# EAGLE design Board (EAGLE 9.0.1)

## Sheet 1 of 3
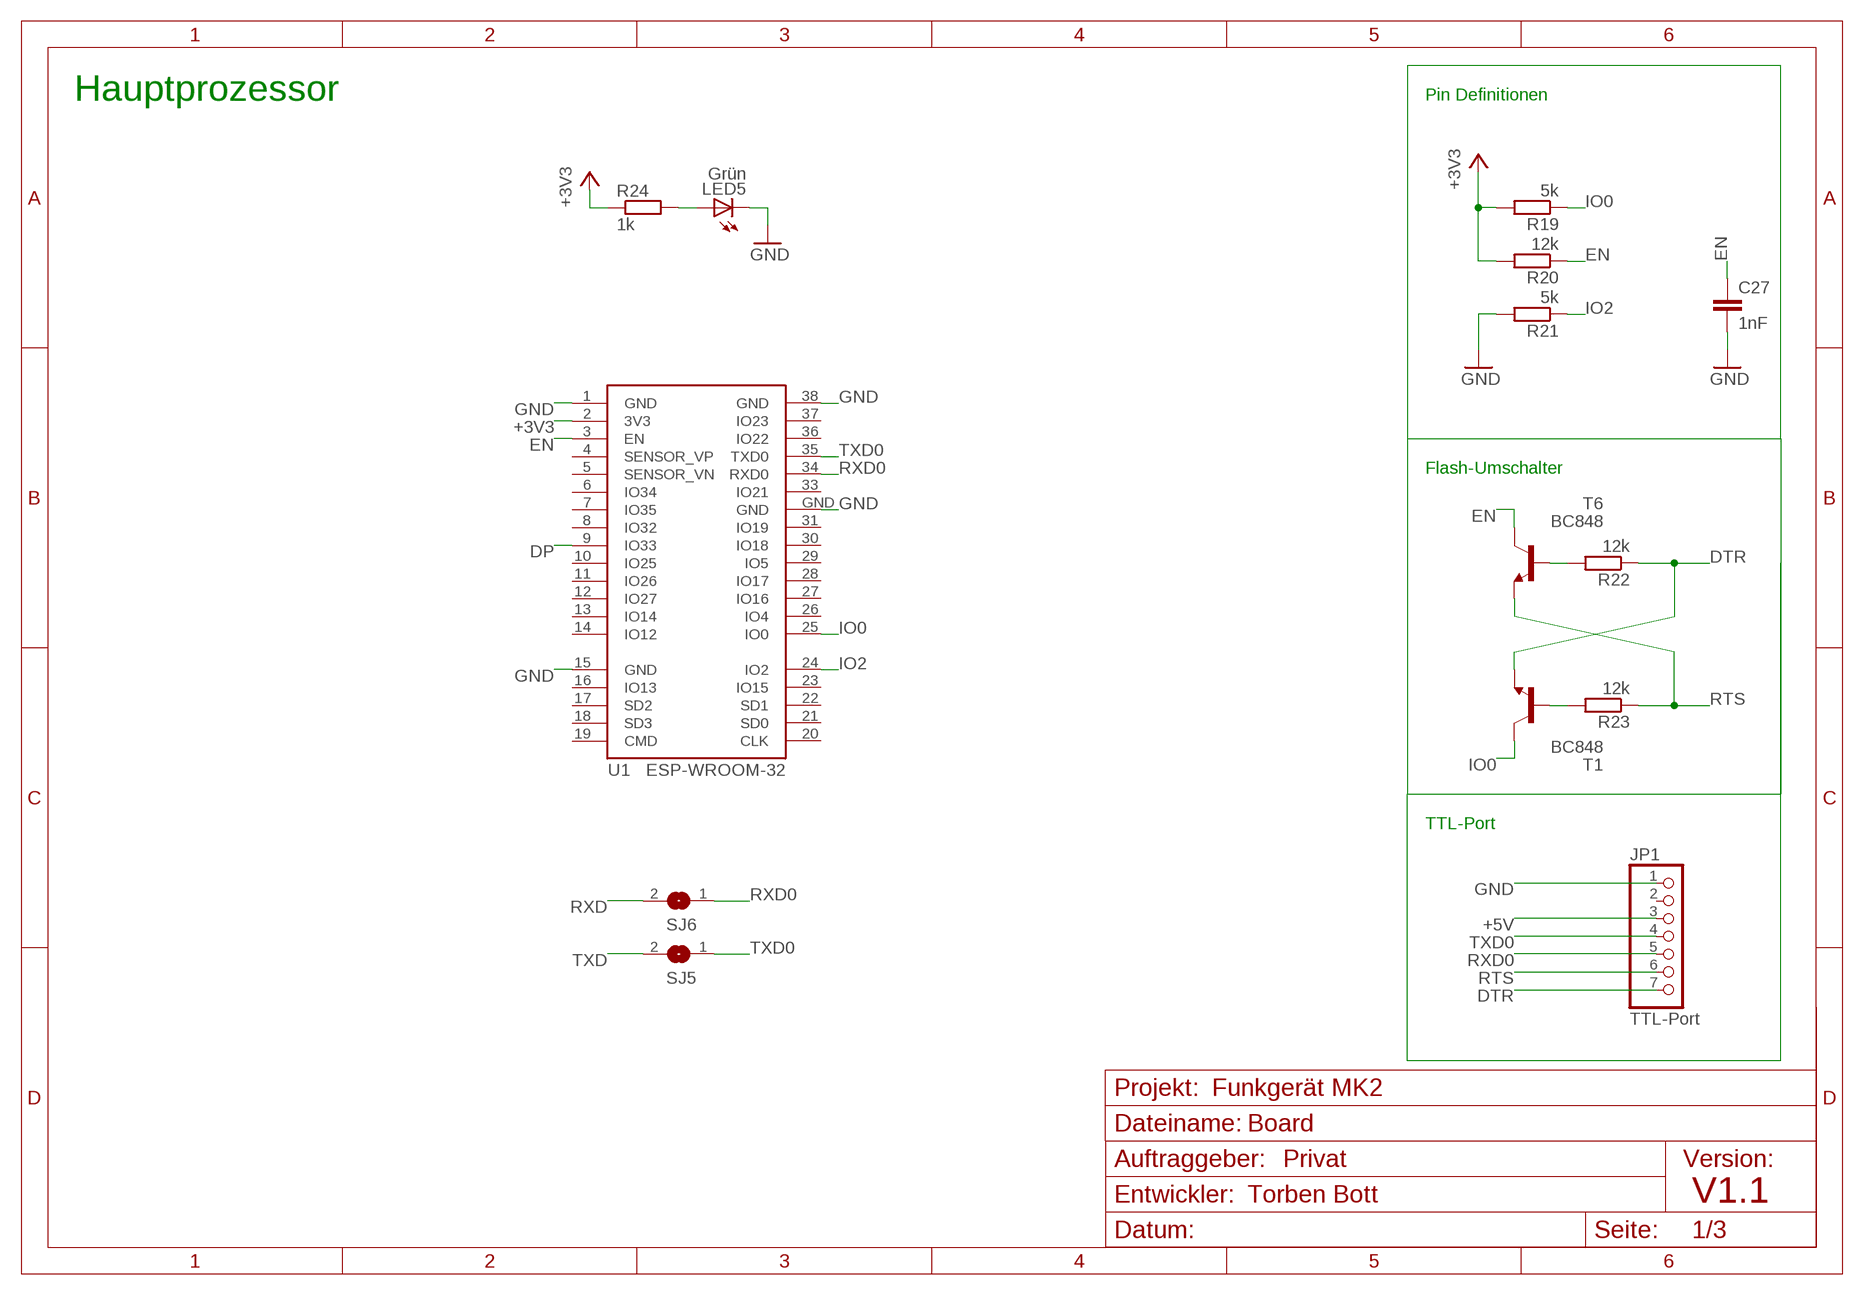
[diagram p0: schematic, sheet 1]

### Parts
C27  1nF  C-EUC0805  [C0805]
JP1  TTL-Port  PINHD-1X7/90  [1X07/90]
LED5  Grün  LEDCHIP-LED0805  [CHIP-LED0805]
R19  5k  R-EU_R0805  [R0805]
R20  12k  R-EU_R0805  [R0805]
R21  5k  R-EU_R0805  [R0805]
R22  12k  R-EU_R0805  [R0805]
R23  12k  R-EU_R0805  [R0805]
R24  1k  R-EU_R0805  [R0805]
SJ5  SJ  [SJ]
SJ6  SJ  [SJ]
T1  BC848  [SOT23]
T6  BC848  [SOT23]
U1  ESP-WROOM-32  [ESP-WROOM-32]

### Nets
+3V3: R19.2 R20.2 R24.1 U1.2(3V3) ; also sheet 2,3
+5V: JP1.3 ; also sheet 2
DP: U1.9(IO33) ; also sheet 3
DTR: JP1.7 R22.1 T1.2(E)
EN: C27.1 R20.1 T6.3(C) U1.3(EN)
GND: C27.2 JP1.1 LED5.C R21.2 U1.1(GND) U1.15(GND) U1.38(GND) U1.GND ; also sheet 2,3
IO0: R19.1 T1.3(C) U1.25(IO0)
IO2: R21.1 U1.24(IO2)
N$40: R23.2 T1.1(B)
N$41: R22.2 T6.1(B)
N$43: LED5.A R24.2
RTS: JP1.6 R23.1 T6.2(E)
RXD: SJ6.2 ; also sheet 3
RXD0: JP1.5 SJ6.1 U1.34(RXD0)
TXD: SJ5.2 ; also sheet 3
TXD0: JP1.4 SJ5.1 U1.35(TXD0)
Unconnected: JP1.2 U1.4(SENSOR_VP) U1.5(SENSOR_VN) U1.6(IO34) U1.7(IO35) U1.8(IO32) U1.10(IO25) U1.11(IO26) U1.12(IO27) U1.13(IO14) U1.14(IO12) U1.16(IO13) U1.17(SD2) U1.18(SD3) U1.19(CMD) U1.20(CLK) U1.21(SD0) U1.22(SD1) U1.23(IO15) U1.26(IO4) U1.27(IO16) U1.28(IO17) U1.29(IO5) U1.30(IO18) U1.31(IO19) U1.33(IO21) U1.36(IO22) U1.37(IO23)

### Notes on the sheet
- Hauptprozessor | Pin Definitionen
- Flash-Umschalter
- TTL-Port
- Funkgerät MK2
- Privat
- Torben Bott | V1.1

## Sheet 2 of 3
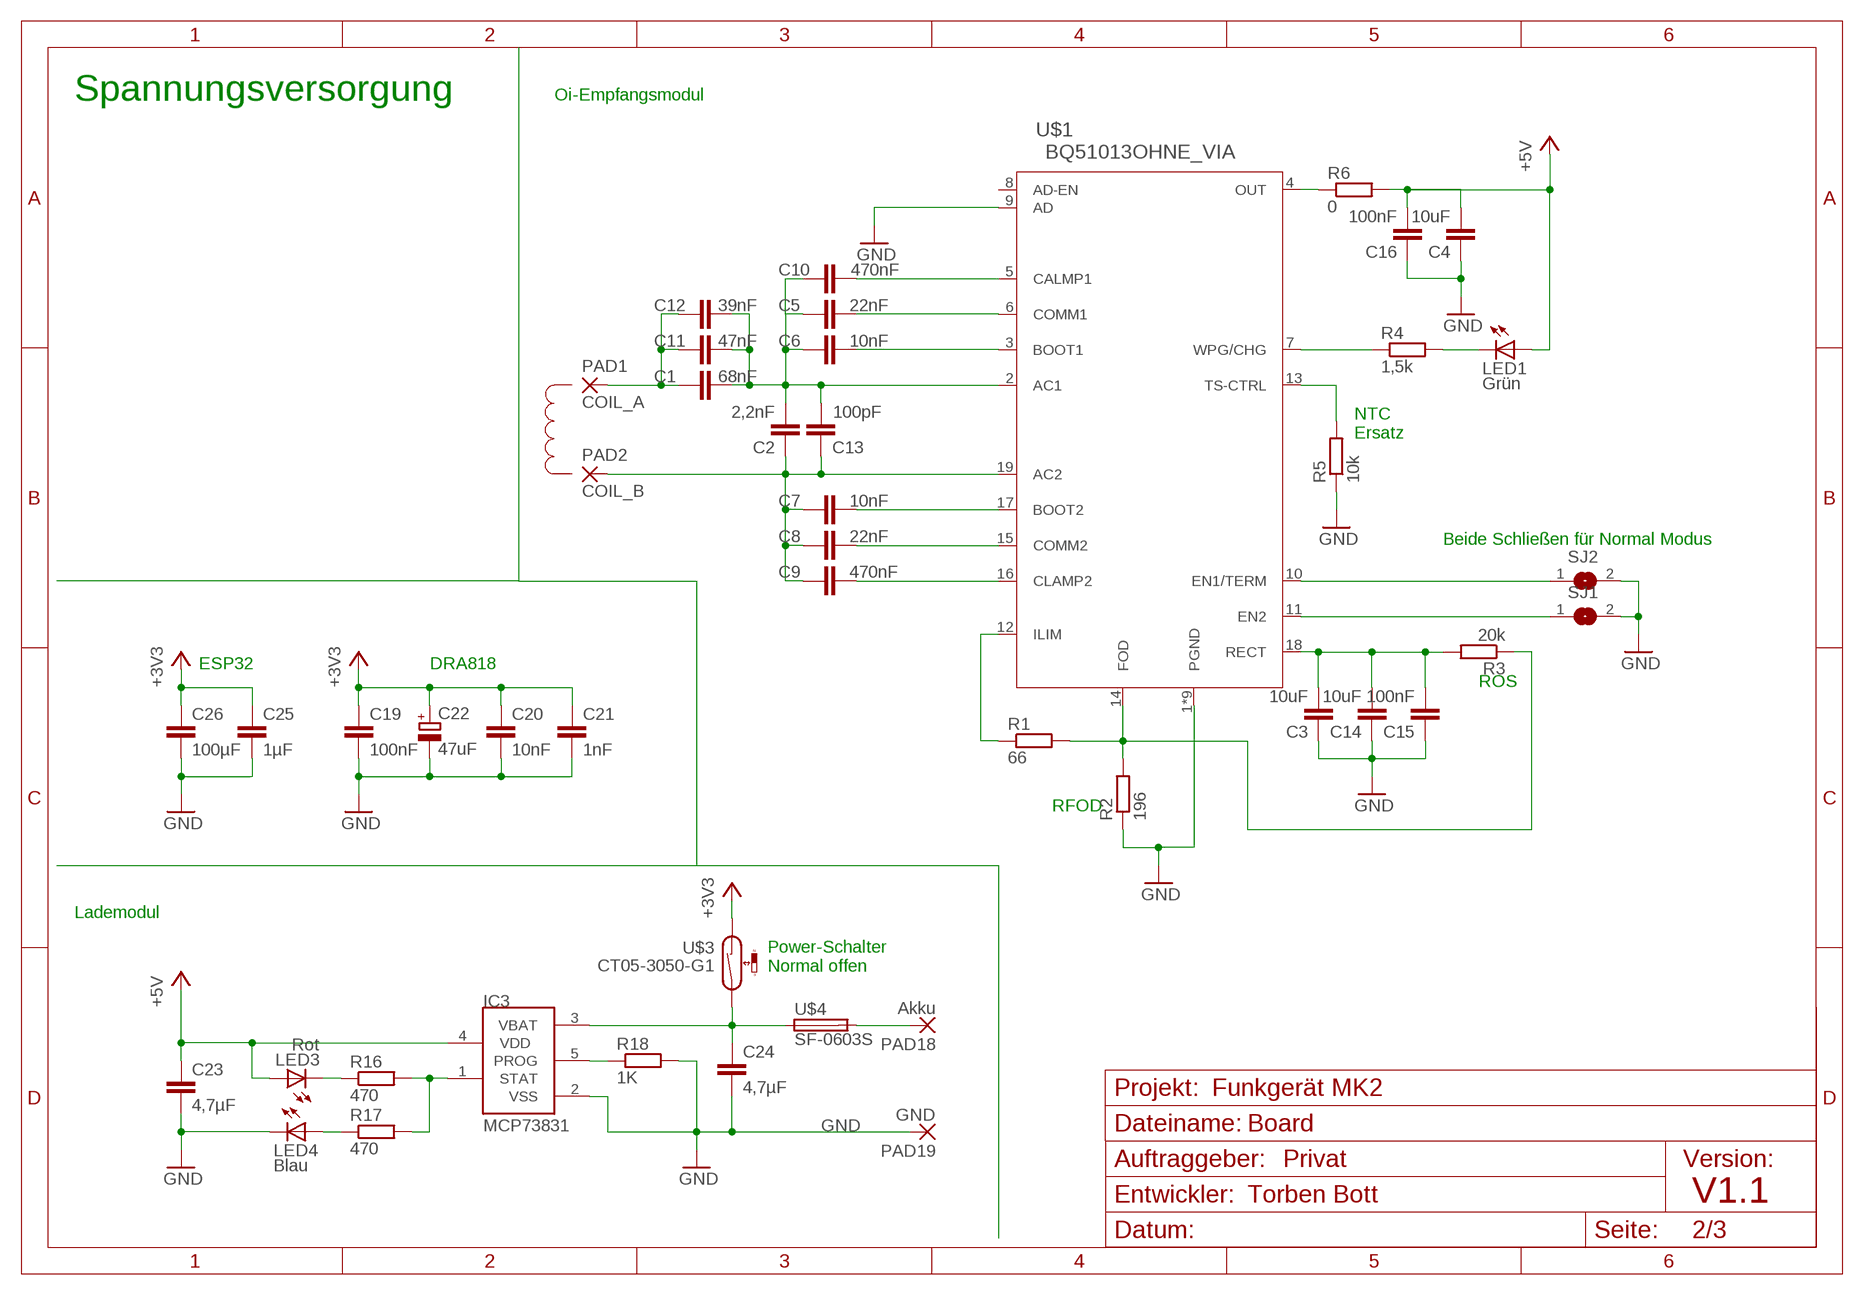
[diagram p1: schematic, sheet 2]

### Parts
C1  68nF  C-EUC0805  [C0805]
C2  2,2nF  C-EUC0805  [C0805]
C3  10uF  C-EUC0805  [C0805]
C4  10uF  C-EUC0805  [C0805]
C5  22nF  C-EUC0805  [C0805]
C6  10nF  C-EUC0805  [C0805]
C7  10nF  C-EUC0805  [C0805]
C8  22nF  C-EUC0805  [C0805]
C9  470nF  C-EUC0805  [C0805]
C10  470nF  C-EUC0805  [C0805]
C11  47nF  C-EUC0805  [C0805]
C12  39nF  C-EUC0805  [C0805]
C13  100pF  C-EUC0805  [C0805]
C14  10uF  C-EUC0805  [C0805]
C15  100nF  C-EUC0805  [C0805]
C16  100nF  C-EUC0805  [C0805]
C19  100nF  C-EUC0805  [C0805]
C20  10nF  C-EUC0805  [C0805]
C21  1nF  C-EUC0805  [C0805]
C22  47uF  CPOL-EUCT6032  [CT6032]
C23  4,7µF  C-EUC0805  [C0805]
C24  4,7µF  C-EUC0805  [C0805]
C25  1µF  C-EUC0805  [C0805]
C26  100µF  C-EUC0805  [C0805]
IC3  MCP73831  [SOT23-5L]
LED1  Grün  LEDCHIP-LED0805  [CHIP-LED0805]
LED3  Rot  LEDCHIPLED_0805  [CHIPLED_0805]
LED4  Blau  LEDCHIPLED_0805  [CHIPLED_0805]
PAD1  COIL_A  WIREPADSMD5-2,5  [5-2,5]
PAD2  COIL_B  WIREPADSMD5-2,5  [5-2,5]
PAD18  Akku  WIREPADSMD5-1,8  [5-1,8]
PAD19  GND  WIREPADSMD5-1,8  [5-1,8]
R1  66  R-EU_R0805  [R0805]
R2  196  R-EU_R0805  [R0805]
R3  20k  R-EU_R0805  [R0805]
R4  1,5k  R-EU_R0805  [R0805]
R5  10k  R-EU_R0805  [R0805]
R6  0  R-EU_R0805  [R0805]
R16  470  R-EU_R0805  [R0805]
R17  470  R-EU_R0805  [R0805]
R18  1K  R-EU_R0805  [R0805]
SJ1  SJ  [SJ]
SJ2  SJ  [SJ]
U$1  BQ51013OHNE_VIA  [QFN20_3,5X4,5_OHNE]
U$3  CT05-3050-G1  [CT10-A2]
U$4  SF-0603S  [R0603]

### Nets
+3V3: C19.1 C20.1 C21.1 C22.+ C25.1 C26.1 U$3.P$1 ; also sheet 1,3
+5V: C4.2 C16.2 C23.1 IC3.4(VDD) LED1.A LED3.A R6.2 ; also sheet 1
BATT+: C24.1 IC3.3(VBAT) U$3.P$2 U$4.1
GND: C3.1 C4.1 C14.1 C15.1 C16.1 C19.2 C20.2 C21.2 C22.- C23.2 C24.2 C25.2 C26.2 IC3.2(VSS) LED4.C PAD19.1(P) R2.1 R5.1 R18.2 SJ1.2 SJ2.2 U$1.1(PGND) U$1.9(AD) U$1.20(PGND) U$1.EXP(PGND) U$1.EXP@7(PGND) U$1.EXP@8(PGND) U$1.EXP@9(PGND) U$1.EXP@10(PGND) U$1.EXP@11(PGND) U$1.EXP@12(PGND) ; also sheet 1,3
N$1: C1.1 C11.1 C12.1 PAD1.1(P)
N$2: C10.1 U$1.5(CALMP1)
N$3: C5.1 U$1.6(COMM1)
N$4: C1.2 C2.2 C5.2 C6.2 C10.2 C11.2 C12.2 C13.2 U$1.2(AC1)
N$5: C7.1 U$1.17(BOOT2)
N$6: C2.1 C7.2 C8.2 C9.2 C13.1 PAD2.1(P) U$1.19(AC2)
N$7: C8.1 U$1.15(COMM2)
N$8: C9.1 U$1.16(CLAMP2)
N$9: C6.1 U$1.3(BOOT1)
N$10: R1.1 U$1.12(ILIM)
N$12: PAD18.1(P) U$4.2
N$13: C3.2 C14.2 C15.2 R3.2 U$1.18(RECT)
N$14: SJ2.1 U$1.10(EN1/TERM)
N$15: LED1.C R4.2
N$16: R6.1 U$1.4(OUT)
N$17: R4.1 U$1.7(WPG/CHG)
N$18: R5.2 U$1.13(TS-CTRL)
N$19: SJ1.1 U$1.11(EN2)
N$36: IC3.1(STAT) R16.2 R17.2
N$37: LED3.C R16.1
N$38: LED4.A R17.1
N$39: IC3.5(PROG) R18.1
N$47: R1.2 R2.2 R3.1 U$1.14(FOD)
Unconnected: U$1.8(AD-EN)

### Notes on the sheet
- Spannungsversorgung | Oi-Empfangsmodul
- NTC
  Ersatz
- Beide Schließen für Normal Modus
- ESP32 | DRA818
- ROS
- RFOD
- Lademodul
- Power-Schalter
  Normal offen
- Funkgerät MK2
- Privat
- Torben Bott | V1.1

## Sheet 3 of 3
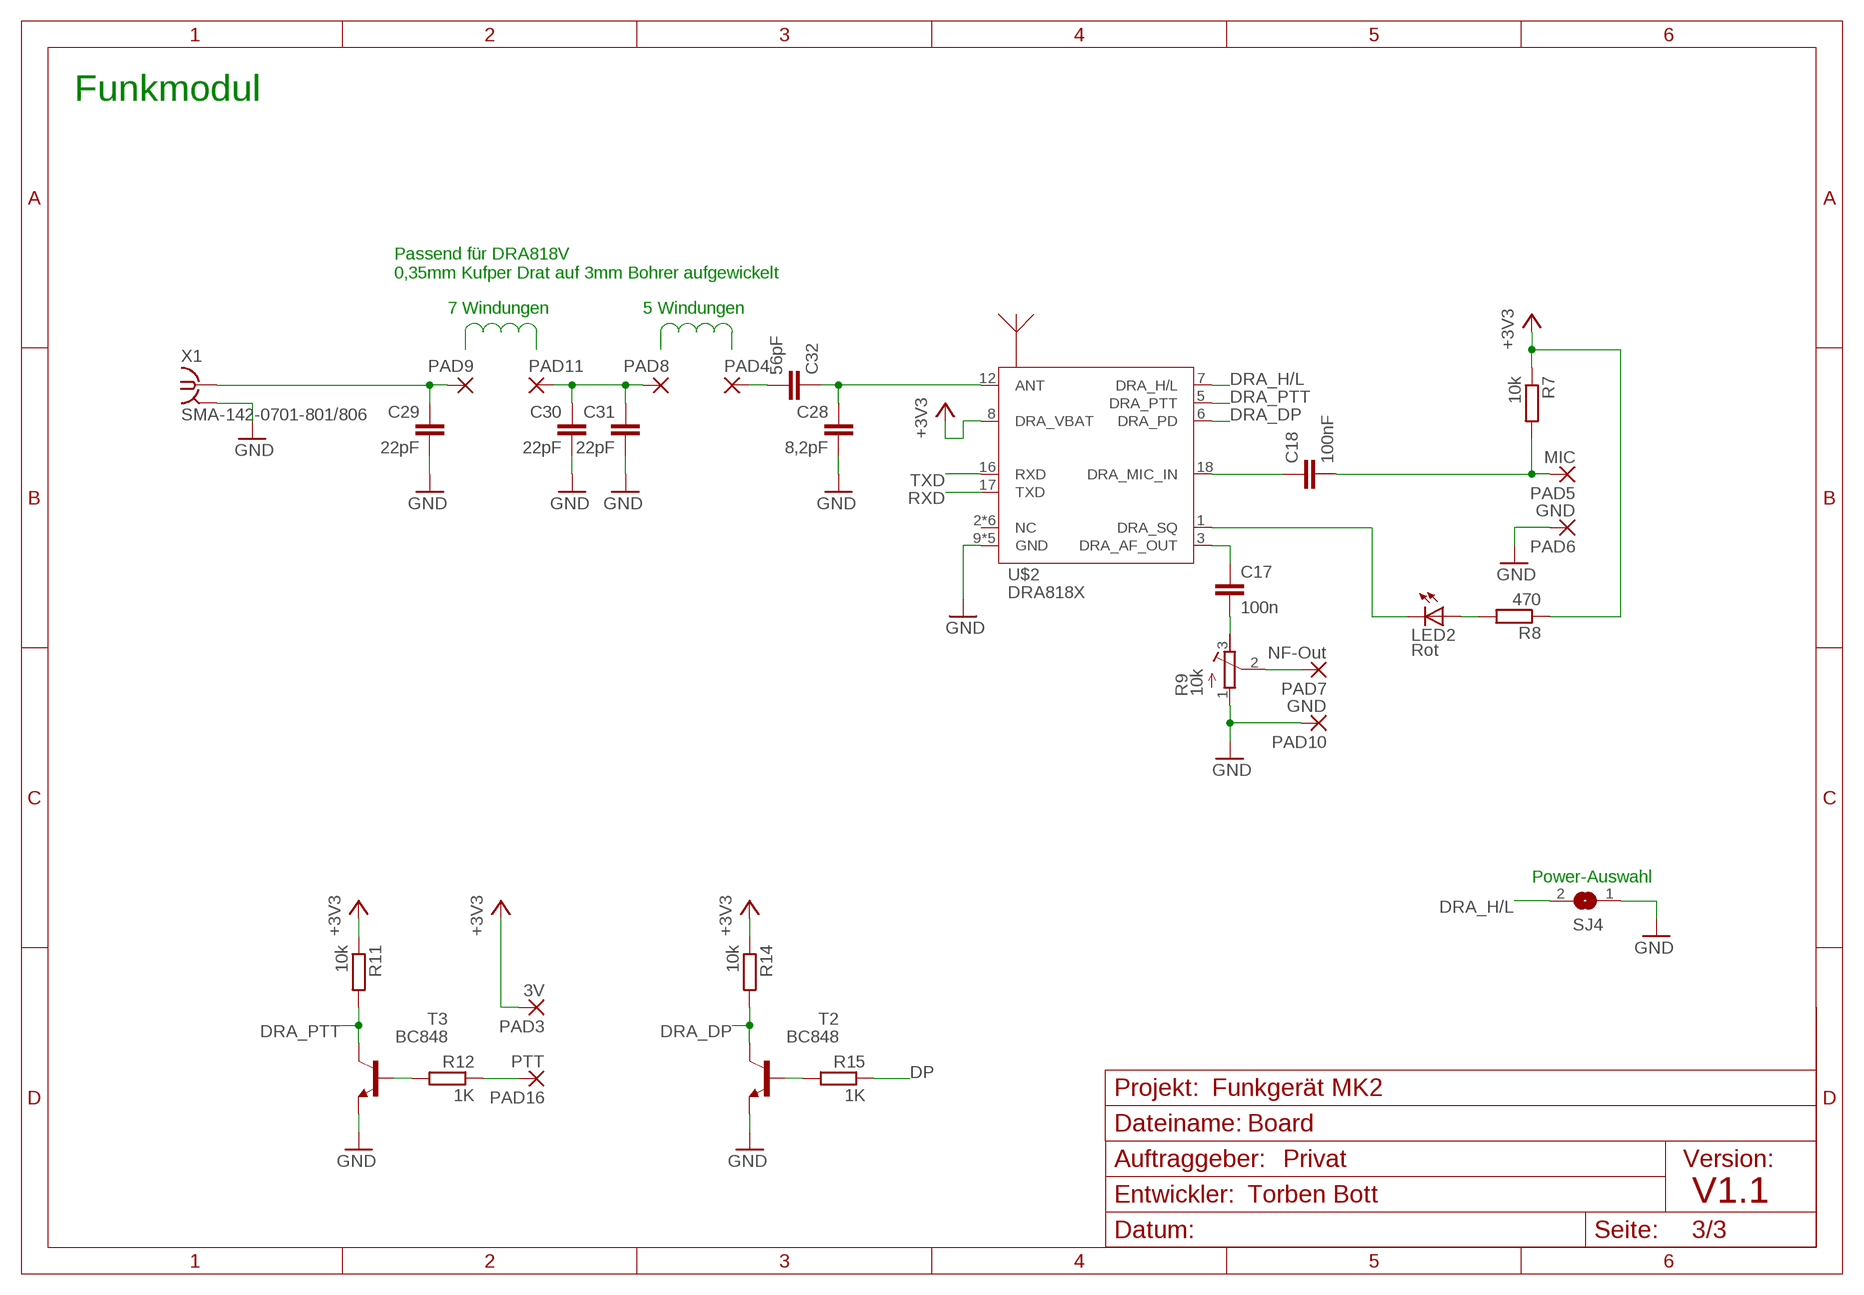
[diagram p2: schematic, sheet 3]

### Parts
C17  100n  C-EUC0805  [C0805]
C18  100nF  C-EUC0805  [C0805]
C28  8,2pF  C-EUC1206K  [C1206K]
C29  22pF  C-EUC1206K  [C1206K]
C30  22pF  C-EUC1206K  [C1206K]
C31  22pF  C-EUC1206K  [C1206K]
C32  56pF  C-EUC1206K  [C1206K]
LED2  Rot  LEDCHIP-LED0805  [CHIP-LED0805]
PAD3  3V  WIREPADSMD5-1,8  [5-1,8]
PAD4  WIREPADSMD5-1,8  [5-1,8]
PAD5  MIC  WIREPADSMD5-1,8  [5-1,8]
PAD6  GND  WIREPADSMD5-1,8  [5-1,8]
PAD7  NF-Out  WIREPADSMD5-1,8  [5-1,8]
PAD8  WIREPADSMD5-1,8  [5-1,8]
PAD9  WIREPADSMD5-1,8  [5-1,8]
PAD10  GND  WIREPADSMD5-1,8  [5-1,8]
PAD11  WIREPADSMD5-1,8  [5-1,8]
PAD16  PTT  WIREPADSMD5-1,8  [5-1,8]
R7  10k  R-EU_R0805  [R0805]
R8  470  R-EU_R0805  [R0805]
R9  10k  R-TRIMMTS63Y  [RTRIMTS63Y]
R11  10k  R-EU_R0805  [R0805]
R12  1K  R-EU_R0805  [R0805]
R14  10k  R-EU_R0805  [R0805]
R15  1K  R-EU_R0805  [R0805]
SJ4  SJ  [SJ]
T2  BC848  [SOT23]
T3  BC848  [SOT23]
U$2  DRA818X  [DRA818X]
X1  SMA-142-0701-801/806  [J502-ND-142-0701-801/806]

### Nets
+3V3: PAD3.1(P) R7.1 R8.1 R11.1 R14.1 U$2.8(DRA_VBAT) ; also sheet 1,2
DP: R15.1 ; also sheet 1
DRA_DP: R14.2 T2.3(C) U$2.6(DRA_PD)
DRA_H/L: SJ4.2 U$2.7(DRA_H/L)
DRA_PTT: R11.2 T3.3(C) U$2.5(DRA_PTT)
GND: C28.2 C29.2 C30.2 C31.2 PAD6.1(P) PAD10.1(P) R9.1(A) SJ4.1 T2.2(E) T3.2(E) U$2.9(GND) U$2.10(GND) U$2.P1(GND) U$2.P2(GND) U$2.P3(GND) X1.G@1 X1.G@2 X1.G@3 X1.G@4 ; also sheet 1,2
N$20: C18.1 U$2.18(DRA_MIC_IN)
N$21: C18.2 PAD5.1(P) R7.2
N$22: LED2.A R8.2
N$23: C17.1 U$2.3(DRA_AF_OUT)
N$24: C17.2 R9.3(E)
N$25: C28.1 C32.1 U$2.12(ANT)
N$26: PAD7.1(P) R9.2(S)
N$27: C32.2 PAD4.1(P)
N$28: C30.1 C31.1 PAD8.1(P) PAD11.1(P)
N$29: LED2.C U$2.1(DRA_SQ)
N$30: R12.2 T3.1(B)
N$31: C29.1 PAD9.1(P) X1.1
N$32: R15.2 T2.1(B)
N$33: PAD16.1(P) R12.1
RXD: U$2.17(TXD) ; also sheet 1
TXD: U$2.16(RXD) ; also sheet 1
Unconnected: U$2.2(NC) U$2.4(NC) U$2.11(NC) U$2.13(NC) U$2.14(NC) U$2.15(NC)

### Notes on the sheet
- Funkmodul
- Passend für DRA818V
  0,35mm Kufper Drat auf 3mm Bohrer aufgewickelt
- 7 Windungen | 5 Windungen
- Power-Auswahl
- Funkgerät MK2
- Privat
- Torben Bott | V1.1

## Library data of the parts
C1-C21 C26 C28-C32 = rcl:C-EU: CAPACITOR, European symbol; SPICEPREFIX: C
C22 = rcl:CPOL-EU: POLARIZED CAPACITOR, European symbol; SPICEPREFIX: C
C23-C25 C27 = rcl:C-EU: CAPACITOR, European symbol
IC3 = microchip-update-2:MCP73831: Miniature Single-Cell, Fully Integrated Li-Ion, Li-Polymer Charge Management Controllers
JP1 = pinhead:PINHD-1X7: PIN HEADER
LED1-LED5 = led:LED: LED OSRAM: - CHIPLED LG R971, LG N971, LY N971, LG Q971, LY Q971, LO R971, LY R971 LH N974, LH R974 LS Q976, LO Q976, LY Q976 LO Q996 - Hyper CHIPLED LW Q18S LB Q993, LB Q99A, LB R99A - SideLED LS A670, LO A670, LY A670, LG A670, LP A670 LB A673, LV A673, LT A673, LW A673 LH A674 LY A675 LS A676, LA A676, LO A676, LY A676, LW A676 LS A679, LY A679, LG A679 - Hyper Micro SIDELED® LS Y876, LA Y876, LO Y876, LY Y876 LT Y87S - SmartLED LW L88C, LW L88S LB L89C, LB L89S, LG L890 LS L89K, LO L89K, LY L89K LS L896, LA L896, LO L896, LY L896 - TOPLED LS T670, LO T670, LY T670, LG T670, LP T670 LSG T670, LSP T670, LSY T670, LOP T670, LYG T670 LG T671, LOG T671, LSG T671 LB T673, LV T673, LT T673, LW T673 LH T674 LS T676, LA T676, LO T676, LY T676, LB T676, LH T676, LSB T676, LW T676 LB T67C, LV T67C, LT T67C, LS T67K, LO T67K, LY T67K, LW E67C LS E67B, LA E67B, LO E67B, LY E67B, LB E67C, LV E67C, LT E67C LW T67C LS T679, LY T679, LG T679 LS T770, LO T770, LY T770, LG T770, LP T770 LB T773, LV T773, LT T773, LW T773 LH T774 LS E675, LA E675, LY E675, LS T675 LS T776, LA T776, LO T776, LY T776, LB T776 LHGB T686 LT T68C, LB T68C - Hyper Mini TOPLED® LB M676 - Mini TOPLED Santana® LG M470 LS M47K, LO M47K, LY M47K Source: http://www.osram.convergy.de LUXEON: - LUMILED® LXK2-PW12-R00, LXK2-PW12-S00, LXK2-PW14-U00, LXK2-PW14-V00 LXK2-PM12-R00, LXK2-PM12-S00, LXK2-PM14-U00 LXK2-PE12-Q00, LXK2-PE12-R00, LXK2-PE12-S00, LXK2-PE14-T00, LXK2-PE14-U00 LXK2-PB12-K00, LXK2-PB12-L00, LXK2-PB12-M00, LXK2-PB14-N00, LXK2-PB14-P00, LXK2-PB14-Q00 LXK2-PR12-L00, LXK2-PR12-M00, LXK2-PR14-Q00, LXK2-PR14-R00 LXK2-PD12-Q00, LXK2-PD12-R00, LXK2-PD12-S00 LXK2-PH12-R00, LXK2-PH12-S00 LXK2-PL12-P00, LXK2-PL12-Q00, LXK2-PL12-R00 Source: www.luxeon.com KINGBRIGHT: KA-3528ASYC Source: www.kingbright.com
PAD1-PAD11 PAD16 PAD18 PAD19 = wirepad:WIREPAD: Wire PAD connect wire on PCB
R1-R8 R11 R14 R24 = rcl:R-EU_: RESISTOR, European symbol; SPICEPREFIX: R
R9 = rcl:R-TRIMM: Trimm resistor; SPICEMODEL: X; SPICEPREFIXL: POT
R12 R15-R23 = rcl:R-EU_: RESISTOR, European symbol
SJ1 SJ2 SJ4-SJ6 = jumper:SJ: SMD solder JUMPER
T1-T3 T6 = transistor:BC848: NPN TRANSISTOR
U1 = esp32:ESP-WROOM-32: Espressif Systems ESP-WROOM-32
U$1 = Eigene Library:BQ51013
U$2 = Eigene Library:DRA818X
U$3 = Eigene Library:CT05-3050-G1; FARNELL: 1081684
U$4 = Eigene Library:SF-0603S; FARNELL: 1652144
X1 = con-coax:SMA-: SMA 50 Ohm End Launch Jack Receptacle - Round Contact Johnson Components Source: www.johnsoncomponents.com .. J502-ND.pdf; MF: JOHNSON COMPONENTS; MPN: 142-0701-801; OC_FARNELL: 1608592; OC_NEWARK: 90F2624

## Board
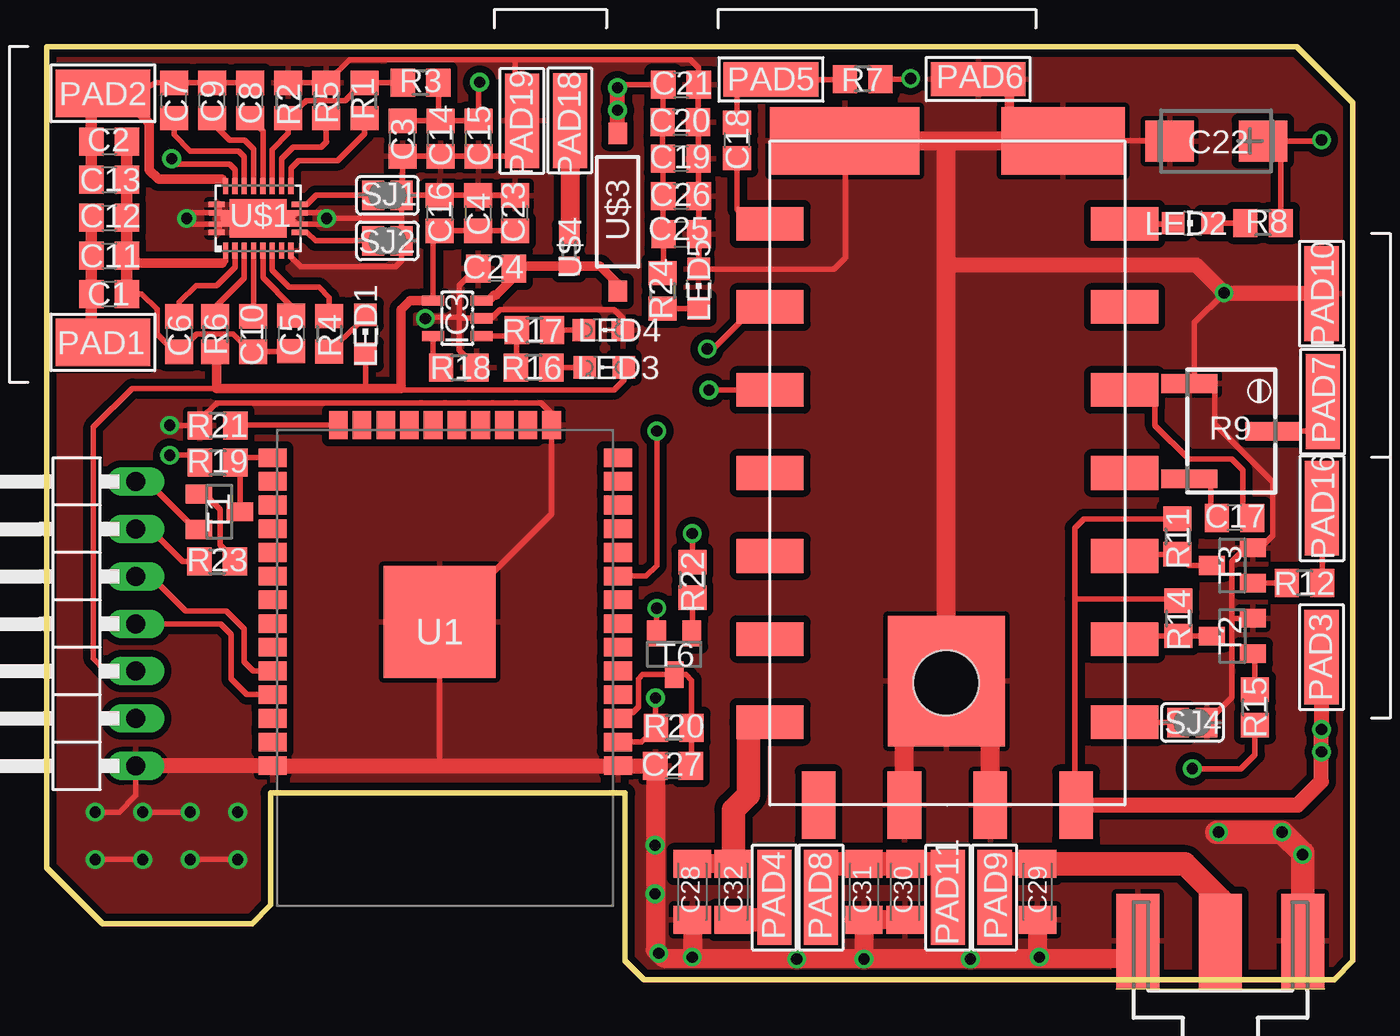
[diagram p3: board, top side]
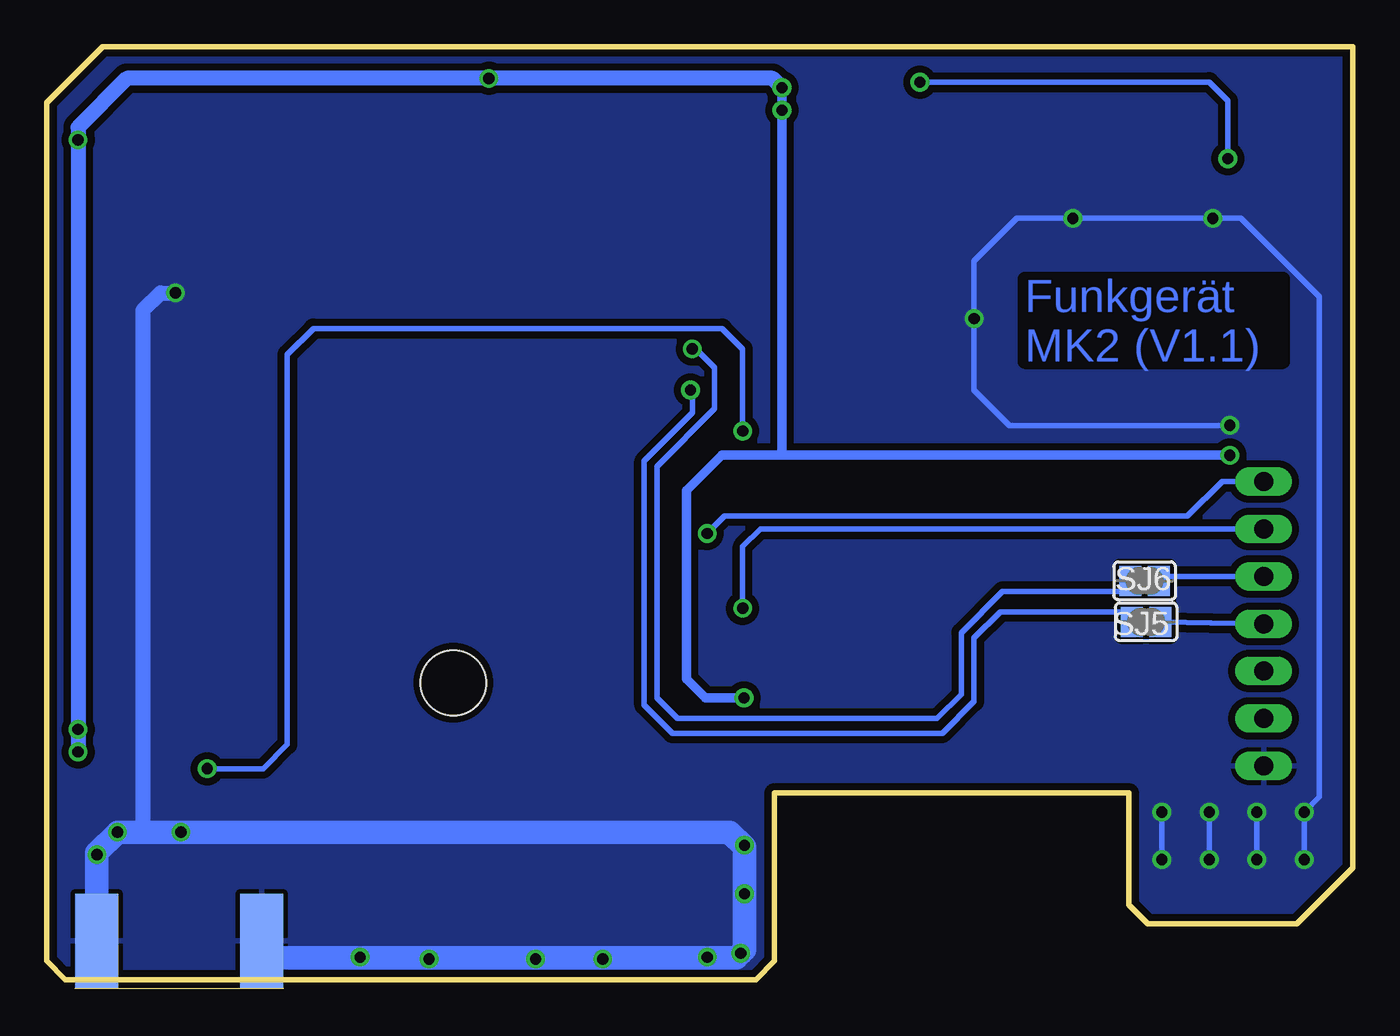
[diagram p4: board, bottom side, seen from below]

Size 70 x 50 mm. Coordinates in mm from the lower left corner, seen from the top.
Outline: 0,50 67,50 70,47 70,1 69,0 32,0 31,1 31,10 12,10 12,4 11,3 3,3 0,6 0,50
Copper layers (1*16): Top 0.035mm / dielectric 1.5mm / Bottom 0.035mm
Design rules "Torben": minimum track width 12mil, minimum drill 0.6mm, track to track 15mil, track to pad 8mil, pad to pad 6mil, via to via 6mil, smd to smd 6mil, copper to edge 15mil, drill to drill 6mil, minimum pad ring 10mil, minimum via ring 8mil, stop-mask expansion 4mil, vias tented up to drill 0mil, thermal gap 10mil
Holes 3.5 mm at 48.2,15.9

### Footprints (pad centres in the part's own frame; a part is rotated, then mirrored left to right if it is on the bottom)
C0805 = smd 1.3 x 1.5: 1 -0.95,0; 2 0.95,0
CT6032 = smd 2.6 x 2.2: + -2.5,0; - 2.5,0
C1206K = smd 1.5 x 2: 1 -1.5,0; 2 1.5,0
SOT23-5L = smd 0.55 x 1.2: 1 -0.95,-1.3; 2 0,-1.3; 3 0.95,-1.3; 4 0.95,1.3; 5 -0.95,1.3
1X07/90 = drill 1.016 long: 1 -7.62,-3.81; 2 -5.08,-3.81; 3 -2.54,-3.81; 4 0,-3.81; 5 2.54,-3.81; 6 5.08,-3.81; 7 7.62,-3.81
CHIP-LED0805 = smd 1.2 x 1.2: A 0,-1.05; C 0,1.05
CHIPLED_0805 = smd 1.2 x 1.2: A 0,-1.05; C 0,1.05
5-2,5 = smd 2.54 x 5.08: 1 0,0
5-1,8 = smd 1.829 x 5.08: 1 0,0
R0805 = smd 1.3 x 1.5: 1 -0.95,0; 2 0.95,0
RTRIMTS63Y = smd 1 x 3: 1 -2.55,-2.25; 2 0,2.25; 3 2.55,-2.25
SJ = smd 1.168 x 1.6: 1 -0.762,0; 2 0.762,0
SOT23 = smd 1 x 1.4: 1 -0.95,-1.1; 2 0.95,-1.1; 3 0,1.1
ESP-WROOM-32 = smd 1.5 x 1: 1 -9.25,7; 2 -9.25,5.73; 3 -9.25,4.46; 4 -9.25,3.19; 5 -9.25,1.92; 6 -9.25,0.65; 7 -9.25,-0.62; 8 -9.25,-1.89; 9 -9.25,-3.16; 10 -9.25,-4.43; 11 -9.25,-5.7; 12 -9.25,-6.97; 13 -9.25,-8.24; 14 -9.25,-9.51; 25 9.25,-9.51; 26 9.25,-8.24; 27 9.25,-6.97; 28 9.25,-5.7; 29 9.25,-4.43; 30 9.25,-3.16; 31 9.25,-1.89; 32 9.25,-0.62; 33 9.25,0.65; 34 9.25,1.92; 35 9.25,3.19; 36 9.25,4.46; 37 9.25,5.73; 38 9.25,7 | smd 1 x 1.5: 15 -5.7,-11.25; 16 -4.43,-11.25; 17 -3.16,-11.25; 18 -1.89,-11.25; 19 -0.62,-11.25; 20 0.65,-11.25; 21 1.92,-11.25; 22 3.19,-11.25; 23 4.46,-11.25; 24 5.73,-11.25 | smd 6 x 6: GND 0.3,-0.7
QFN20_3,5X4,5_OHNE = smd 0.85 x 0.28: 1 -2.225,-0.75; 10 2.225,-0.75; 11 2.225,0.75; 20 -2.225,0.75 | smd 0.28 x 0.85: 2 -1.75,-1.725; 3 -1.25,-1.725; 4 -0.75,-1.725; 5 -0.25,-1.725; 6 0.25,-1.725; 7 0.75,-1.725; 8 1.25,-1.725; 9 1.75,-1.725; 12 1.75,1.725; 13 1.25,1.725; 14 0.75,1.725; 15 0.25,1.725; 16 -0.25,1.725; 17 -0.75,1.725; 18 -1.25,1.725; 19 -1.75,1.725 | smd 3.05 x 2.05: EXP 0,0 | smd 1.125 x 0.28: EXP@7 -2.075,0.3; EXP@8 -2.075,-0.3; EXP@9 2.075,0.3; EXP@10 2.075,-0.3 | smd 0.45 x 0.4: EXP@11 -1.75,0; EXP@12 1.75,0
DRA818X = smd 1.8 x 3.6: 1 -13.35,9.5; 2 -8.9,9.5; 3 -4.45,9.5; 4 0,9.5; 5 4.45,9.5; 6 8.9,9.5; 7 13.35,9.5; 12 13.35,-9.5; 13 8.9,-9.5; 14 4.45,-9.5; 15 0,-9.5; 16 -4.45,-9.5; 17 -8.9,-9.5; 18 -13.35,-9.5 | smd 3.6 x 1.8: 8 17.8,6.9; 9 17.8,2.3; 10 17.8,-2.3; 11 17.8,-6.9 | smd 7 x 6.25: P1 11.15,-0.05 | smd 3.6 x 6.6: P2 -17.8,6.2 | smd 3.6 x 8: P3 -17.8,-5.5
CT10-A2 = smd 1.14 x 1: P$1 -3.95,0; P$2 4.5,0
R0603 = smd 1 x 1.1: 1 -0.85,0; 2 0.85,0
J502-ND-142-0701-801/806 = smd 5.08 x 2.286: 1 2.565,0; G@1 2.565,4.42; G@2 2.565,-4.42 | smd 5.08 x 2.286 bottom: G@3 2.565,4.42; G@4 2.565,-4.42

### Placement (x,y rotation side)
C1  3.35,36.75 0 top
C2  3.35,44.91 0 top
C3  19.07,45.07 90 top
C4  23.12,41.08 270 top
C5  13.1,34.63 270 top
C6  7.1,34.6 270 top
C7  6.83,47.11 90 top
C8  10.91,47.11 90 top
C9  8.87,47.11 90 top
C10  11.08,34.6 270 top
C11  3.35,38.79 0 top
C12  3.35,40.83 0 top
C13  3.35,42.87 0 top
C14  21.11,45.07 90 top
C15  23.15,45.07 90 top
C16  21.06,41.08 270 top
C17  63.66,24.75 180 top
C18  37,44.97 90 top
C19  33.98,44 0 top
C20  33.96,45.95 0 top
C21  33.99,47.95 0 top
C22  62.68,44.94 180 top
C23  25.1,41.07 90 top
C24  24.08,38.1 180 top
C25  34.01,39.95 0 top
C26  33.99,41.98 0 top
C27  33.57,11.45 180 top
C28  34.6,4.7 270 top
C29  53.1,4.7 270 top
C30  46,4.7 270 top
C31  43.8,4.7 270 top
C32  36.8,4.7 270 top
IC3  22.01,35.44 90 top
JP1  0.97,19.07 90 top
LED1  17.09,34.58 0 top
LED2  61.42,40.54 90 top
LED3  29.88,32.81 90 top
LED4  29.83,34.81 270 top
LED5  34.94,37.03 0 top
PAD1  3.02,34.15 90 top
PAD2  3.02,47.5 90 top
PAD3  68.32,17.28 0 top
PAD4  39,4.4 0 top
PAD5  38.82,48.24 90 top
PAD6  49.92,48.26 90 top
PAD7  68.38,30.98 0 top
PAD8  41.5,4.4 0 top
PAD9  50.8,4.4 0 top
PAD10  68.32,36.76 0 top
PAD11  48.3,4.4 0 top
PAD16  68.34,25.26 0 top
PAD18  28.04,46.04 180 top
PAD19  25.47,46.02 180 top
R1  17.03,47.11 90 top
R2  12.95,47.11 270 top
R3  20.04,48.08 0 top
R4  15.15,34.61 270 top
R5  14.99,47.11 270 top
R6  9.04,34.6 270 top
R7  43.73,48.25 180 top
R8  65.19,40.55 180 top
R9  63.49,29.39 270 top
R11  60.6,23.74 270 top
R12  67.41,21.25 180 top
R14  60.65,19.36 270 top
R15  64.75,14.59 90 top
R16  26.09,32.8 180 top
R17  26.14,34.8 180 top
R18  22.09,32.8 0 top
R19  9.16,27.7 180 top
R20  33.61,13.5 180 top
R21  9.16,29.7 180 top
R22  34.6,21.41 270 top
R23  9.14,22.4 0 top
R24  33,36.91 270 top
SJ1  18.26,42.03 0 top
SJ2  18.26,39.59 0 top
SJ4  61.4,13.77 180 top
SJ5  11.08,19.17 180 bottom
SJ6  11.16,21.37 180 bottom
T1  9.26,25.07 270 top
T2  63.54,18.41 90 top
T3  63.54,22.19 90 top
T6  33.63,17.44 180 top
U1  21.36,18.46 180 top
U$1  11.34,40.79 0 top
U$2  48.27,27.15 270 top
U$3  30.6,41.4 270 top
U$4  28,39.1 90 top
X1  62.9,-0.5 90 top

### Tracks (layer width: path | path; a pad name or v marks a point on that pad's centre or on a via)
+3V3  (via drill 0.6)
  Top 0.305: R14.1 60.56,20.4 55.1,20.4 | R11.1 55.59,24.69 55.1,24.2 55.1,20.4 | 55.1,20.4 55.1,9.42 U$2.8 | R19.2 7.81,28.1 v6.6,28.1 | U1.2 31.89,12.73 R20.2 32.62,13.54 v32.62,15.1 | R24.1 33.06,37.92 C25.1 33.04,39.97 C26.1 C19.1 33.01,44.02 C20.1 33.04,45.98 C21.1 | U$3.P$1 30.6,45.4 | C21.1 32.99,47.9 | R7.1 46.25,48.25 v46.3,48.3 | C21.1 30.75,47.95 v30.6,47.8 | C22.+ 65.5,44.94 | 65.5,44.94 68.26,44.94 v68.32,45 | R8.1 66.14,44.3 65.5,44.94
  Top 0.813: U$2.8 67.05,9.35 68.32,10.62 v68.32,12.2 v68.32,13.4 PAD3.1 | 30.6,45.4 v30.6,46.6 | U$3.P$1 v30.6,47.8
  Bottom 0.508: v6.6,28.1 30.6,28.1 | 30.6,28.1 33.8,28.1 35.7,26.2 35.7,16.1 34.7,15.1 v32.62,15.1 | v30.6,47.8 30.6,28.1
  Bottom 0.813: v30.6,47.8 31.1,48.3 v46.3,48.3 65.7,48.3 68.32,45.68 v68.32,45 v68.32,12.2
+5V
  Top 0.305: C23.1 C4.2 C16.2 | 17.2,33.52 LED1.A 17.1,31.69 | 20.5,39.7 20.63,39.7 C16.2 | LED3.A 30.93,32.13 30.4,31.6 19,31.6 19,31.69 | C16.2 20.71,39.78 IC3.4 | JP1.3 3.23,16.53 3.2,16.5 2.5,17.2 2.5,29.6 4.59,31.69 9.1,31.69 | 9.1,33.59 R6.2
  Top 0.508: IC3.4 19.49,36.39 19,35.9 19,31.69 17.1,31.69 9.1,31.69 9.1,33.59
BATT+
  Top 0.305: IC3.3 23.59,36.39
  Top 0.508: U$3.P$2 30.6,37.3 29.65,38.25 U$4.1 25.18,38.25 C24.1 25.03,37.63 24.09,36.69 23.98,36.69 23.68,36.39 IC3.3
DP  (via drill 0.6)
  Top 0.305: U1.9 32.12,21.62 32.7,22.2 v32.7,29.4 | v61.4,11.3 64,11.3 64.75,12.05 R15.1
  Bottom 0.305: v61.4,11.3 58.4,11.3 57.1,12.6 57.1,33.5 55.7,34.9 33.8,34.9 32.7,33.8 v32.7,29.4
DRA_DP
  Top 0.305: U$2.6 57.93,18.41 R14.2 T2.3
DRA_H/L
  Top 0.305: SJ4.2 57.8,13.77 U$2.7
DRA_PTT
  Top 0.305: U$2.5 57.86,22.79 R11.2 61.2,22.19 T3.3
DTR  (via drill 0.6)
  Top 0.305: JP1.7 5.41,26.69 7.98,24.12 T1.2 | R22.1 v34.6,23.9
  Bottom 0.305: JP1.7 7,26.7 8.86,24.84 33.66,24.84 v34.6,23.9
EN
  Top 0.305: U1.3 30.91,14.3 31.39,14.3 31.72,14.62 31.72,16.12 31.94,16.34 T6.3 34.26,16.34 34.56,16.04 R20.1 34.56,11.49 C27.1
GND  (via drill 0.6)
  Top 0.305: R2.1 R5.1 16.23,49.3 25.1,49.3 | 19.07,41.98 C3.1 C14.1 C15.1 24.82,44.12 25.1,44.4 25.1,45.65 | 19.07,41.98 SJ1.2 19.02,40.8 | 19.07,41.98 19.12,42.03 C16.1 C4.1 C23.2 25.2,42.12 | 19.02,40.8 SJ2.2 19.02,38.52 18.7,38.2 13.6,38.2 13.09,38.71 U$1.9 | 49.2,16 49.3,16.1 | 64.24,19.36 T2.2 63.56,19.36 63.5,19.3 | 61.5,31.94 62.46,31.94 62.6,31.8 62.6,29.77 65.7,26.67 65.7,23.8 65.04,23.14 T3.2 64.24,23.14 63.5,22.4 63.5,19.3 | 61.5,31.94 R9.1 | SJ4.1 63.5,15.11 63.5,19.3 | U$1.EXP@7 U$1.EXP@8 | U$1.20 9.27,41.39 U$1.EXP@7 | U$1.EXP@8 9.27,40.19 U$1.1 | U$1.EXP@7 9.56,40.79 U$1.EXP@11 U$1.EXP@12 | 13.11,40.79 U$1.EXP@9 14.71,41.09 v15,40.8 | 13.11,40.79 U$1.EXP@12 | 13.11,40.79 U$1.EXP@10 14.69,40.49 v15,40.8 | U$1.EXP@7 7.79,41.09 v7.5,40.8 7.81,40.49 U$1.EXP@8 | 19.02,40.8 v15,40.8 | U$1.EXP U$1.EXP@12 | 21,11.46 21.06,11.52 U1.GND 21.26,19.16 27.06,24.96 U1.15 27.06,30.06 27.2,30.2 26.5,30.9 9.1,30.9 8.21,30.01 R21.2 v6.6,29.7 | R18.2 22.15,33.69 22.15,33.7 22.1,33.74 22.1,35.5 | 22.1,35.5 22.16,35.44 IC3.2 23.84,35.44 24.31,35.91 30.39,35.91 30.88,35.42 LED4.C | 22.1,35.5 20.38,35.5 v20.3,35.42 | U1.1 | 22.1,35.5 22.1,37.2 23,38.1 C24.2 | 25.1,45.65 25.1,49.3 | C27.2 | PAD19.1 25.1,45.65 | 25.1,49.3 34.5,49.3 34.94,48.86 C21.2 34.91,47.92 C20.2 34.93,45.93 C19.2 C26.2 34.96,41.96 C25.2 34.96,38.1 LED5.C 42.18,38.08 42.8,38.7 42.8,44.95 U$2.P3 40.35,44.95 39.66,45.64 | 44.52,44.97 44.5,44.95 | 56.15,44.95 U$2.P2 C22.- | PAD10.1 68.2,36.88 68.2,38.2 | v63.1,36.8 61.5,35.2 61.5,31.94 | JP1.1 4.78,9.87 3.88,8.97 v2.61,8.97 | v2.61,6.43 v5.15,6.43 | v5.15,8.97 v7.69,8.97 | v10.23,6.43 v7.69,6.43
  Top 0.305: v40.2,1.1 43.76,1.1 43.8,1.14 | v49.5,1.1 53.06,1.1 53.1,1.14
  Top 0.508: PAD6.1 51.04,48.26 51.6,47.7 51.6,44.95
  Top 0.813: PAD10.1 63.14,36.76 v63.1,36.8 61.6,38.3 48.22,38.3 | 42.8,44.95 44.5,44.95 | U$2.P1 49.2,16 | JP1.1 U1.38 U1.1 32.57,11.46 32.6,11.43
  Top 1.016: 32.6,11.43 C27.2 32.62,1.58 v32.8,1.4 33.06,1.14 34.6,1.14 | U$2.P3 44.5,44.95 48,44.95 | 48,44.95 51.6,44.95 U$2.P2 | U$2.P1 48.22,38.3 48.22,44.73 48,44.95 | U$2.10 45.97,13.75 U$2.P1 | U$2.P1 50.57,13.65 U$2.9 50.57,8.83 | C30.2 C31.2 43.8,1.14 | C29.2 53.1,1.14 | 34.6,1.14 43.8,1.14 | 43.8,1.14 53.1,1.14 | C28.2 v34.6,1.2 34.6,1.14 | 53.1,1.14 57.56,1.14 X1.G@3
  Top 1.27: X1.G@2 67.32,6.78 v66.2,7.9 v62.8,7.9 62.7,7.9
  Bottom 0.305: v6.6,29.7 18.4,29.7 20.3,31.6 v20.3,35.42 20.3,38.5 18,40.8 v15,40.8 v7.5,40.8 6,40.8 1.8,36.6 1.8,9.78 v2.61,8.97 v2.61,6.43 | v5.15,6.43 v5.15,8.97 | v7.69,6.43 v7.69,8.97 | v10.23,8.97 v10.23,6.43
  Bottom 0.813: 63.15,36.8 v63.1,36.8 63.9,36.8 64.84,35.86 64.84,7.96 64.9,7.9
  Bottom 1.27: X1.G@2 67.32,6.78 v66.2,7.9 64.9,7.9 v62.8,7.9 33.4,7.9 32.6,7.1 v32.6,4.6 32.6,1.6 v32.8,1.4 33.03,1.17 57.58,1.17 X1.G@3
  other vias: 43.8,1.1 53.2,1.2 32.6,7.2 67.3,6.7
  pour Bottom: 0,50 0,6 3,3 11,3 12,4 12,10 31,10 31,1 32,0 69,0 70,1 70,47 67,50
  pour Top: 0,50 0,6 3,3 11,3 12,4 12,10 31,10 31,1 32,0 69,0 70,1 70,47 67,50
IO0
  Top 0.305: T1.3 10.36,27.45 R19.1 10.38,27.97 U1.25
IO2
  Top 0.305: U1.24 R21.1
N$1
  Top 0.305: 2.9,34.27 PAD1.1
  Top 0.61: C12.1 C11.1 C1.1 2.4,34.77 PAD1.1
N$2
  Top 0.305: U$1.5 C10.1
N$3
  Top 0.305: U$1.6 11.59,37.61 13.1,36.1 C5.1
N$4
  Top 0.305: U$1.2 9.59,38.51 9.6,38.5 9.4,38.4 | C5.2 13.07,33.65 C10.2 10.95,33.65 10,34.6 8.05,34.6 C6.2 6.85,33.65 5.92,34.58 5.92,35.93 5.1,36.75 4.5,36.75 C1.2
  Top 0.508: 9.4,38.4 4.99,38.4 C11.2
  Top 0.61: C2.2 C13.2 C12.2 C11.2 4.3,36.95 4.5,36.75
N$5
  Top 0.305: U$1.17 10.59,44.11 10.3,44.4 7.7,44.4 6.83,45.27 C7.1
N$6
  Top 0.305: C8.2 C9.2 C7.2 5.86,48.06 4.31,47.31 | 3.01,47.21 PAD2.1 | 4.31,47.31 3.01,47.21 | U$1.19 9.59,42.81 9.4,42.9 | 2.4,46.6 3.01,47.21 | 4.49,47.31 4.31,47.31
  Top 0.508: 9.4,42.9 6,42.9 5.51,43.39 5.51,45.89 4.49,47.01 4.49,47.31
  Top 0.61: PAD2.1 2.4,46.88 C2.1 C13.1
N$7
  Top 0.305: U$1.15 11.59,45.48 C8.1
N$8
  Top 0.305: U$1.16 11.09,44.51 10.6,45 9.8,45 8.87,45.93 C9.1
N$9
  Top 0.305: U$1.3 10.09,38.19 9.1,37.2 8,37.2 7.1,36.3 C6.1
N$10
  Top 0.305: U$1.12 13.09,43.49 13.5,43.9 15.6,43.9 17.03,45.33 R1.1
N$12
  Top 1.016: PAD18.1 28.04,39.99 U$4.2
N$13  (via drill 0.6)
  Top 0.305: 21,46.02 C14.2 C15.2 23.15,48.05 v23.2,48.1 | 21,46.02 C3.2 | R3.2 21,46.02 | U$1.18 10.09,43.41 9.8,43.7 7,43.7 v6.7,44
  Bottom 0.305: v23.2,48.1 7.7,48.1 6.7,47.1 v6.7,44
N$14
  Top 0.305: U$1.10 13.96,40.04 14.41,39.59 SJ2.1
N$15
  Top 0.305: R4.2 17.19,35.6 LED1.C
N$16
  Top 0.305: U$1.4 10.59,37.59 9.04,36.04 R6.1
N$17
  Top 0.305: U$1.7 12.09,38.01 13,37.1 14.6,37.1 15.15,36.55 R4.1
N$18
  Top 0.305: U$1.13 12.59,43.99 13.2,44.6 14.7,44.6 15,44.9 14.99,44.91 R5.2
N$19
  Top 0.305: U$1.11 13.94,41.54 14.43,42.03 SJ1.1
N$20
  Top 0.305: C18.1 37,41.3 37.8,40.5 U$2.18
N$21
  Top 0.305: 37.04,46.06 C18.2 37,47.7 37.54,48.24 PAD5.1 R7.2
N$22
  Top 0.305: LED2.A R8.2
N$23
  Top 0.305: C17.1 64.61,24.79 64.1,25.3 64.1,27.3 63.5,27.9 61.2,27.9 59.4,29.7 59.4,31.1 58.9,31.6 U$2.3
N$24
  Top 0.305: C17.2 62.4,25.06 62.4,26.5 62.06,26.84 R9.3
N$25
  Top 1.016: C32.1 C28.1
  Top 1.27: U$2.12 37.6,13.8 37.6,9.9 36.8,9.1 C32.1
N$26
  Top 0.305: 66.59,29.39 R9.2 67.79,29.39 68.38,29.98 PAD7.1
N$27
  Top 1.016: 39,3.8 PAD4.1
  Top 1.27: C32.2 39,3.2 39,3.8
N$28
  Top 1.27: PAD11.1 48.3,6.2 C30.1 C31.1 41.5,6.2 PAD8.1
N$29
  Top 0.305: U$2.1 60.33,40.5 LED2.C
N$30
  Top 0.305: R12.2 T3.1
N$31
  Top 1.016: 50.8,6.2 PAD9.1
  Top 1.27: X1.1 62.9,4.3 61,6.2 C29.1 50.8,6.2
N$32
  Top 0.305: T2.1 64.75,17.35 R15.2
N$33
  Top 0.305: PAD16.1 68.36,25.04 R12.1
N$36
  Top 0.305: R16.2 25.19,32.85 R17.2 24.88,34.49 IC3.1
N$37
  Top 0.305: R16.1 LED3.C
N$38
  Top 0.305: R17.1 LED4.A
N$39
  Top 0.305: R18.1 20.71,32.93 IC3.5
N$40
  Top 0.305: T1.1 8.48,26.02 9.3,25.2 9.3,23.29 10.09,22.5 R23.2
N$41
  Top 0.305: R22.2 34.6,18.56 T6.1
N$43
  Top 0.305: R24.2 34.92,35.96 LED5.A
N$47
  Top 0.305: R3.1 17.05,48.08 R1.2 16.93,48.03 16,47.1 13.9,47.1 13.8,47 13.79,47 R2.2 12.95,45.35 12.09,44.49 U$1.14
RTS  (via drill 0.6)
  Top 0.305: JP1.6 5.55,24.15 7.3,22.4 R23.1 | T6.2 32.68,19.88 v32.7,19.9
  Bottom 0.305: v32.7,19.9 32.7,23.2 31.75,24.15 JP1.6
RXD  (via drill 0.6)
  Top 0.305: U$2.17 37.95,36.05 35.7,33.8 v35.4,33.8
  Bottom 0.305: v35.4,33.8 35.2,33.8 34.2,32.8 34.2,30.6 37.3,27.5 37.3,15.1 36.19,13.99 22.28,13.99 20.99,15.28 20.99,18.58 18.77,20.8 12.4,20.8 12.4,20.89 SJ6.2
RXD0
  Top 0.305: U1.34 11.06,16.54 10.59,17.01 10.59,18.78 9.61,19.76 7.44,19.76 5.59,21.61 JP1.5
  Bottom 0.305: JP1.5 10.36,21.61 SJ6.1
TXD  (via drill 0.6)
  Top 0.305: U$2.16 v35.5,31.6
  Bottom 0.305: v35.5,31.6 35.39,31.48 35.39,30.38 37.99,27.78 37.99,14.72 36.47,13.2 22,13.2 20.3,14.9 20.3,18.3 18.9,19.7 12.2,19.7 11.84,19.34 SJ5.2
TXD0
  Top 0.305: JP1.4 9.33,19.07 9.9,18.5 9.9,16.1 10.73,15.27 U1.35
  Bottom 0.305: 7.61,19.1 JP1.4 SJ5.1

### Text on the board
Bottom: Funkgerät / MK2 (V1.1)
tNames: Akku | Micro | Qi-Spule | Lautsprecher | PTT | Antenne